# Altium schematic sheet CON_NB2_EXTEND_A16.SchDoc: NB2-Extender A 16-Pin Header
size A4; Organization: Altium Limited.; Address1: Level 3, 12a Rodborough Rd; Address2: Frenchs Forest 2086; Address3: NSW; Address4: AUSTRALIA; SheetNumber: 1; SheetTotal: 100
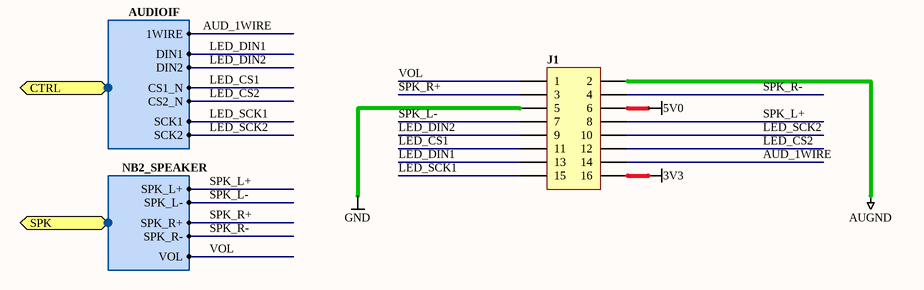
[diagram p0: CON_NB2_EXTEND_A16.SchDoc]

## Parts
J1  TYCO 969973-8  [HDR2X8_SMT]  (value not drawn)

## Ports
CTRL (harness AUDIOIF), SPK (harness NB2_SPEAKER)

## Harnesses
NB2_SPEAKER: SPK_L-, SPK_L+, SPK_R-, SPK_R+, VOL
AUDIOIF: CS1_N, CS2_N, SCK1, 1WIRE, DIN1, DIN2, SCK2

## Nets
3V3: J1.16
5V0: J1.6
AUGND: J1.2
GND: J1.5
AUD_1WIRE: J1.14 ; port CTRL.1WIRE
LED_CS1: J1.11 ; port CTRL.CS1_N
LED_CS2: J1.12 ; port CTRL.CS2_N
LED_DIN1: J1.13 ; port CTRL.DIN1
LED_DIN2: J1.9 ; port CTRL.DIN2
LED_SCK1: J1.15 ; port CTRL.SCK1
LED_SCK2: J1.10 ; port CTRL.SCK2
SPK_L+: J1.8 ; port SPK.SPK_L+
SPK_L-: J1.7 ; port SPK.SPK_L-
SPK_R+: J1.3 ; port SPK.SPK_R+
SPK_R-: J1.4 ; port SPK.SPK_R-
VOL: J1.1 ; port SPK.VOL

## Notes on the sheet
- Sheet Title
- Project Title
- Size:
- Date:
- A4
- Assy:
- Time:
- Revision:
- Sheet
- of
- File:

## Library data of the parts
J1 = D-300-0061: Header, 2x8, 0.1", Straight, SMT; Max Current: mA; Category: Connector; Connector type: Header; Mounting Technology: Surface Mount; Status: Unreleased